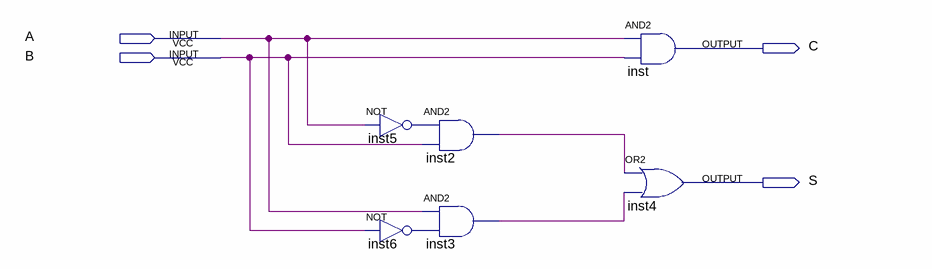
[diagram p0: schematic sheet]
// Quartus schematic Halfadder.bdf as structural Verilog: 6 symbols, 4 pins
module Halfadder (
  input  A,
  input  B,
  output C,
  output S
);

  wire inst2_out, inst3_out, inst5_out, inst6_out;

  not inst5 (inst5_out, A);
  not inst6 (inst6_out, B);
  and inst2 (inst2_out, inst5_out, B);
  and inst3 (inst3_out, A, inst6_out);
  and inst (C, A, B);
  or inst4 (S, inst2_out, inst3_out);
endmodule
